# Altium schematic sheet FLASH.SchDoc
size A4; Date: 2026/04/16; ApprovedBy: NA; Author: 邱上峯; CompanyName: JFM常裕富士機工; Engineer: 邱上峯; Revision: V1.0; SheetNumber: 4; SheetTotal: 8; Pcb Name: NA
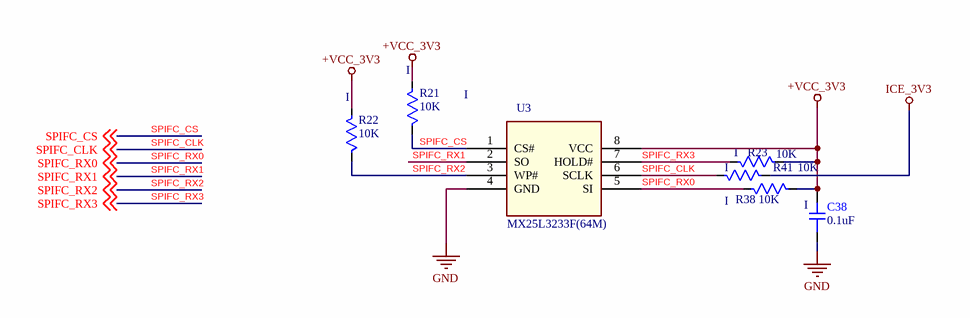
[diagram p0: FLASH.SchDoc]

## Parts
C38  0.1uF  BOM: I  [C0402]
R21  10K  BOM: I  [R0402]
R22  10K  BOM: I  [R0402]
R23  10K  BOM: I  [R0402]
R38  10K  BOM: I  [R0402]
R41  10K  BOM: I  [R0402]
U3  MX25L3233F(64M)  BOM: I  [SOIC127P790X216-8N(MX25L3233F)]

## Nets
+VCC_3V3: C38.2 R21.2 R22.2 R23.1 R38.1 U3.8(VCC)
GND: C38.1 U3.4(GND)
ICE_3V3: R41.1
SPIFC_CLK: R41.2 U3.6(SCLK) ; off-sheet SPIFC_CLK
SPIFC_CS: R21.1 U3.1(CS#) ; off-sheet SPIFC_CS
SPIFC_RX0: R38.2 U3.5(SI) ; off-sheet SPIFC_RX0
SPIFC_RX1: U3.2(SO) ; off-sheet SPIFC_RX1
SPIFC_RX2: R22.1 U3.3(WP#) ; off-sheet SPIFC_RX2
SPIFC_RX3: R23.2 U3.7(HOLD#) ; off-sheet SPIFC_RX3

## Notes on the sheet
- Title:
- Project:
- Date:
- Author:
- Revision:
- Engineer:
- Pcb Name:
- Sheet
- ApprovedBy:
- of

## Library data of the parts
C38 = Cap
R21-R23 R38 R41 = Res
U3 = SOP-8: MX25L3233F(32M)